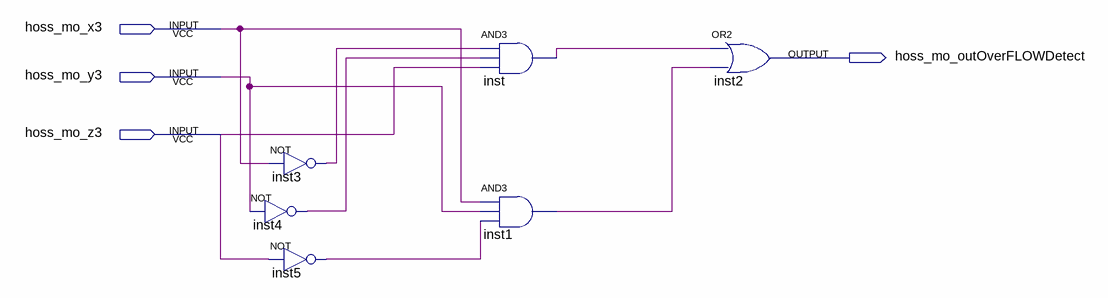
[diagram p0: schematic sheet]
// Quartus schematic overflowDetector.bdf as structural Verilog: 6 symbols, 4 pins
module overflowDetector (
  input  hoss_mo_x3,
  input  hoss_mo_y3,
  input  hoss_mo_z3,
  output hoss_mo_outOverFLOWDetect
);

  wire inst1_out, inst3_out, inst4_out, inst5_out, inst_out;

  not inst3 (inst3_out, hoss_mo_x3);
  not inst4 (inst4_out, hoss_mo_y3);
  not inst5 (inst5_out, hoss_mo_z3);
  and inst (inst_out, inst3_out, inst4_out, hoss_mo_z3);
  and inst1 (inst1_out, hoss_mo_x3, hoss_mo_y3, inst5_out);
  or inst2 (hoss_mo_outOverFLOWDetect, inst_out, inst1_out);
endmodule
